# EAGLE schematic 2364_ROM-el_v1 (EAGLE 7.7.0)
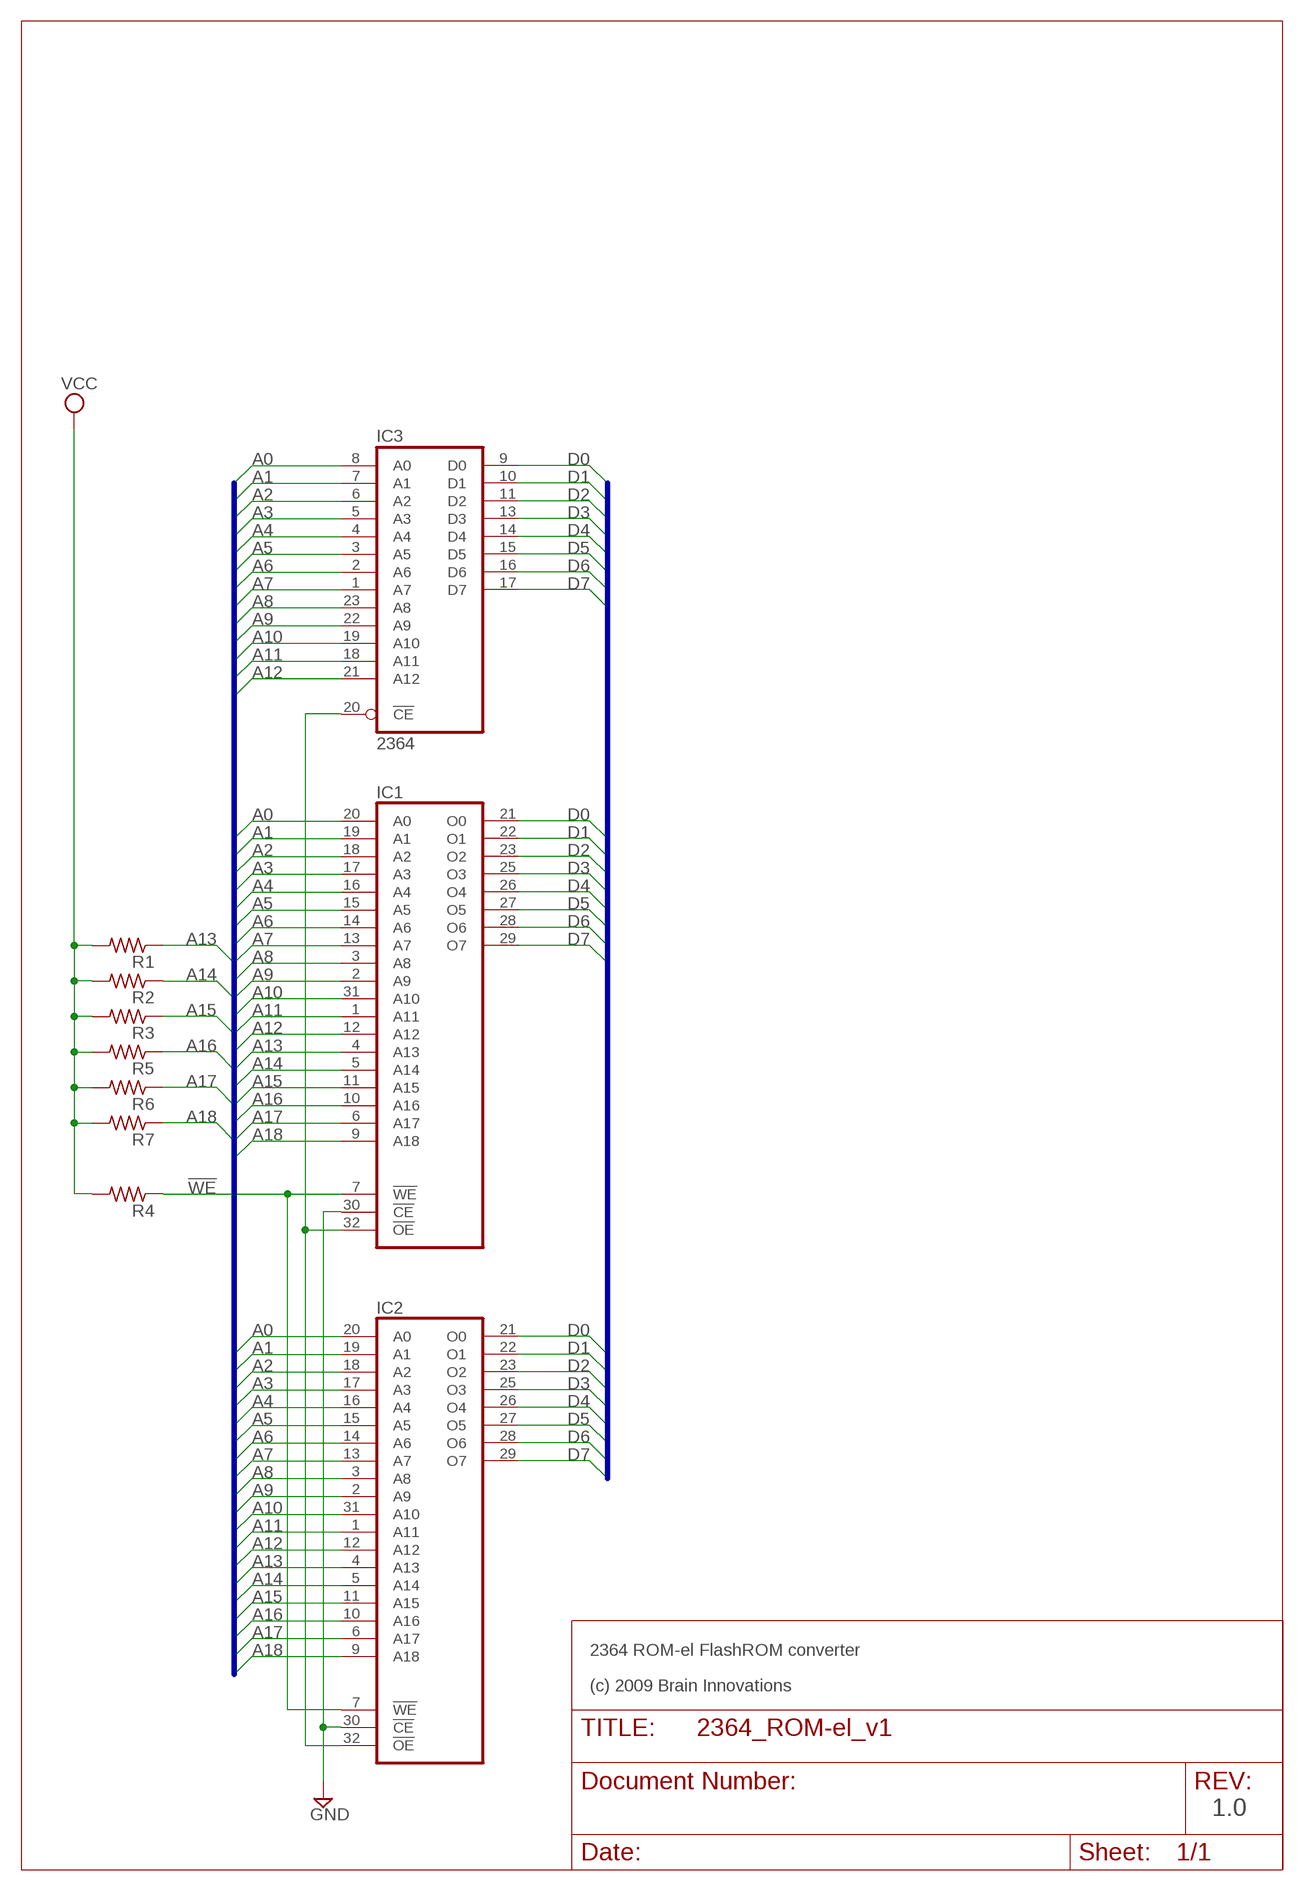
[diagram p0: schematic, sheet 1]

## Parts
IC1  FLASH_RAM4096KB'T'  [TSOP32]
IC2  FLASH_RAM4096KB'V'  [VSOP32]
IC3  2364  2364-RP  [DIL24-ROUNDPAD]
R1  R-US_R0805  [R0805]
R2  R-US_R0805  [R0805]
R3  R-US_R0805  [R0805]
R4  R-US_R0805  [R0805]
R5  R-US_R0805  [R0805]
R6  R-US_R0805  [R0805]
R7  R-US_R0805  [R0805]

## Nets
!WE: IC1.7(!WE) IC2.7(!WE) R4.1
A0: IC1.20(A0) IC2.20(A0) IC3.8(A0)
A1: IC1.19(A1) IC2.19(A1) IC3.7(A1)
A2: IC1.18(A2) IC2.18(A2) IC3.6(A2)
A3: IC1.17(A3) IC2.17(A3) IC3.5(A3)
A4: IC1.16(A4) IC2.16(A4) IC3.4(A4)
A5: IC1.15(A5) IC2.15(A5) IC3.3(A5)
A6: IC1.14(A6) IC2.14(A6) IC3.2(A6)
A7: IC1.13(A7) IC2.13(A7) IC3.1(A7)
A8: IC1.3(A8) IC2.3(A8) IC3.23(A8)
A9: IC1.2(A9) IC2.2(A9) IC3.22(A9)
A10: IC1.31(A10) IC2.31(A10) IC3.19(A10)
A11: IC1.1(A11) IC2.1(A11) IC3.18(A11)
A12: IC1.12(A12) IC2.12(A12) IC3.21(A12)
A13: IC1.4(A13) IC2.4(A13) R1.1
A14: IC1.5(A14) IC2.5(A14) R2.1
A15: IC1.11(A15) IC2.11(A15) R3.1
A16: IC1.10(A16) IC2.10(A16) R5.1
A17: IC1.6(A17) IC2.6(A17) R6.1
A18: IC1.9(A18) IC2.9(A18) R7.1
D0: IC1.21(O0) IC2.21(O0) IC3.9(D0)
D1: IC1.22(O1) IC2.22(O1) IC3.10(D1)
D2: IC1.23(O2) IC2.23(O2) IC3.11(D2)
D3: IC1.25(O3) IC2.25(O3) IC3.13(D3)
D4: IC1.26(O4) IC2.26(O4) IC3.14(D4)
D5: IC1.27(O5) IC2.27(O5) IC3.15(D5)
D6: IC1.28(O6) IC2.28(O6) IC3.16(D6)
D7: IC1.29(O7) IC2.29(O7) IC3.17(D7)
GND: IC1.30(!CE) IC2.30(!CE)
N$1: IC1.32(!OE) IC2.32(!OE) IC3.20(!CE)
VCC: R1.2 R2.2 R3.2 R4.2 R5.2 R6.2 R7.2

## Buses
A[0..18]
D[0..7]

## Notes on the sheet
- 2364 ROM-el FlashROM converter
- (c) 2009 Brain Innovations
- 1.0

## Power pins joined to a net without a drawn wire
GND: IC1.24(GND) IC2.24(GND) IC3.12(GND)
VCC: IC1.8(VCC) IC2.8(VCC) IC3.24(VCC)

## Library data of the parts
IC1 IC2 = memory-jedec:FLASH_RAM4096KB
IC3 = commodore:2364
R1-R7 = resistor:R-US_: RESISTOR, American symbol